# EAGLE design MysensorsATSHA_EEprom (EAGLE 6.5.0)
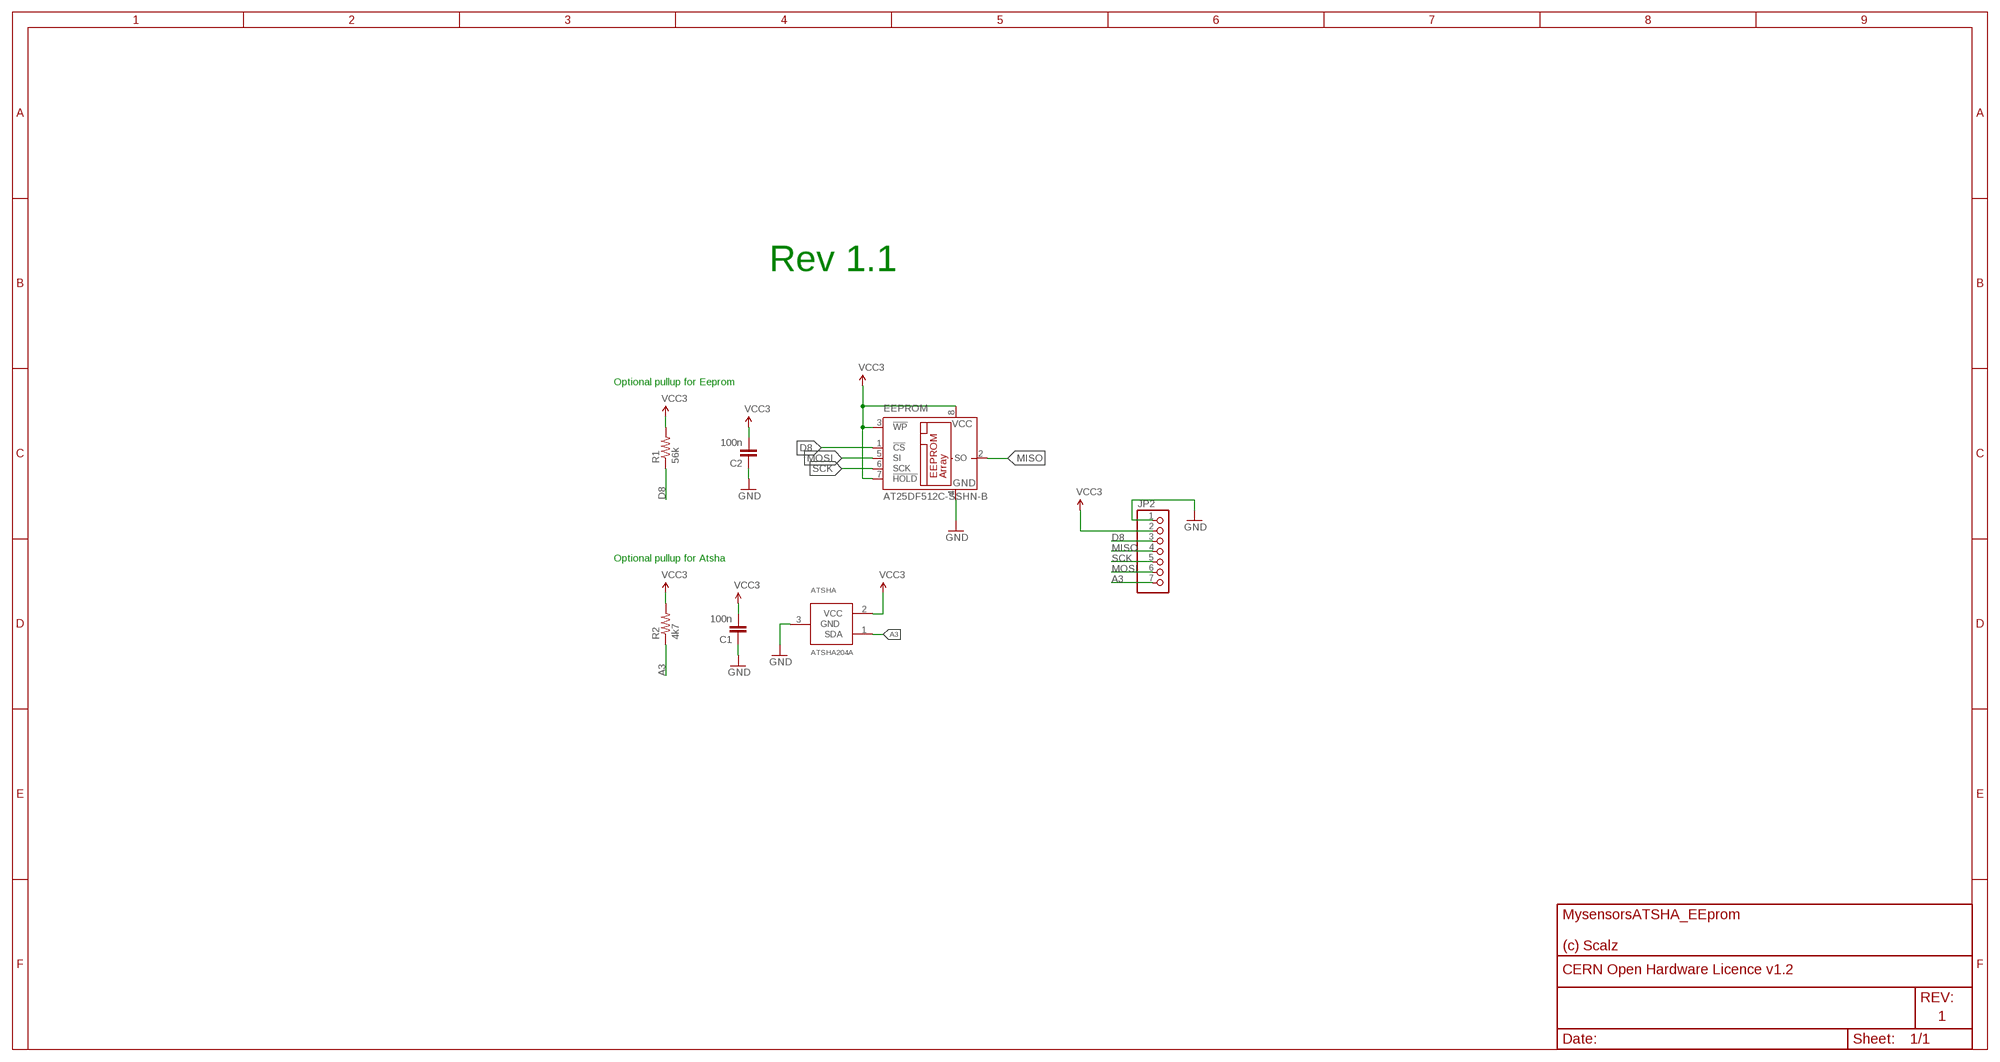
[diagram p0: schematic, sheet 1]

## Parts
ATSHA  ATSHA204A  [SOT23]
C1  100n  CAP1206  [1206]
C2  100n  CAP1206  [1206]
EEPROM  AT25DF512C-SSHN-B  25AA080SN  [SO-08]
JP2  PINHD-1X7  [1X07]
R1  56k  RESISTOR1206  [1206]
R2  4k7  RESISTOR1206  [1206]

## Nets
A3: ATSHA.1(SDA) JP2.7 R2.1
D8: EEPROM.1(!CS) JP2.3 R1.1
GND: ATSHA.3(GND) C1.1 C2.1 EEPROM.4(GND) JP2.1
MISO: EEPROM.2(SO) JP2.4
MOSI: EEPROM.5(SI) JP2.6
SCK: EEPROM.6(SCK) JP2.5
VCC: ATSHA.2(VCC) C1.2 C2.2 EEPROM.3(!WP) EEPROM.7(!HOLD) EEPROM.8(VCC) JP2.2 R1.2 R2.2 ; supply symbol labelled VCC3

## Notes on the sheet
- Rev 1.1
- Optional pullup for Eeprom
- Optional pullup for Atsha

## Library data of the parts
ATSHA = Sensor_tbowmo:ATSHA204A
C1 C2 = LowPowerLab:CAP: Capacitor Standard 0603 ceramic capacitor, and 0.1" leaded capacitor.
EEPROM = microchip:25*: Serial EEPROM 4K/ 8K , SPI bus; MF: MICROCHIP; MPN: 25AA080/SN; OC_FARNELL: 1816072; OC_NEWARK: 92C7351
JP2 = pinhead:PINHD-1X7: PIN HEADER
R1 R2 = SparkFun-Resistors:RESISTOR: Resistor Basic schematic elements and footprints for 0603, 1206, and PTH resistors.

## Net classes
1 Power: width 0.406 mm

## Board
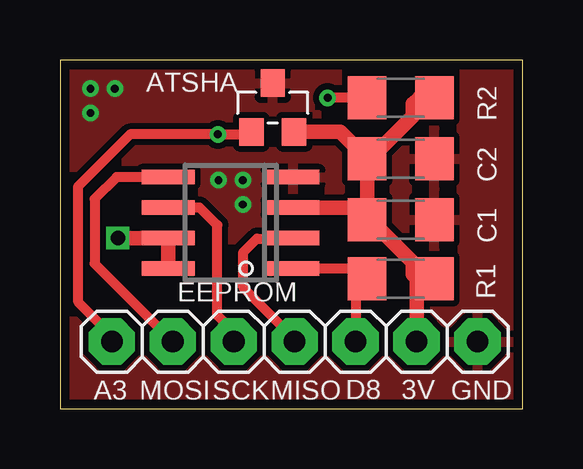
[diagram p1: board, top side]
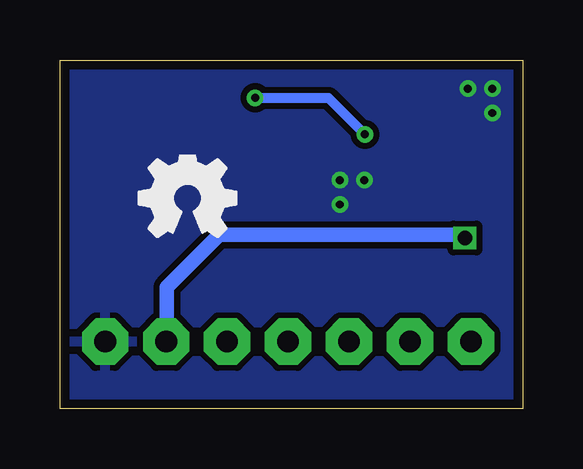
[diagram p2: board, bottom side, seen from below]

Size 19.28 x 14.53 mm. Coordinates in mm from the lower left corner, seen from the top.
Outline: 0,0 19.28,0 19.28,14.53 0,14.53 0,0
Copper layers (1*16): Top 0.0356mm / dielectric 1.5011mm / Bottom 0.0356mm
Design rules "LaenPCBOrder": minimum track width 6mil, minimum drill 13mil, track to track 6mil, track to pad 6mil, pad to pad 6mil, via to via 6mil, smd to smd 6mil, copper to edge 15mil, drill to drill 6mil, minimum pad ring 7mil, minimum via ring 7mil, stop-mask expansion 3mil, vias tented up to drill 0mil, thermal gap 10mil

### Footprints (pad centres in the part's own frame; a part is rotated, then mirrored left to right if it is on the bottom)
SOT23 = smd 1.016 x 1.143: 1 -0.889,-1.016; 2 0.889,-1.016; 3 0,1.016
1206 = smd 1.6 x 1.8: 1 -1.4,0; 2 1.4,0
SO-08 = smd 0.6 x 2.2: 1 -1.905,-2.6; 2 -0.635,-2.6; 3 0.635,-2.6; 4 1.905,-2.6; 5 1.905,2.6; 6 0.635,2.6; 7 -0.635,2.6; 8 -1.905,2.6
1X07 = drill 0.9 pad 1.93 octagon: 1 -7.62,0; 2 -5.08,0; 3 -2.54,0; 4 0,0; 5 2.54,0; 6 5.08,0; 7 7.62,0

### Placement (x,y rotation side)
ATSHA  8.86,12.55 0 top
C1  14.2,7.87 180 top
C2  14.2,10.41 180 top
EEPROM  7.11,7.75 90 top
JP2  9.78,2.79 180 top
R1  14.2,5.41 0 top
R2  14.2,12.95 0 top

### Tracks (layer width: path | path; a pad name or v marks a point on that pad's centre or on a via)
A3  (via drill 0.33 pad 0.64)
  Top 0.406: JP2.7 2.16,3.05 0.76,4.45 0.76,9.27 2.92,11.43 v6.58,11.43 7.87,11.43 ATSHA.1 | R2.1 v11.15,12.95
  Bottom 0.406: v11.15,12.95 8.1,12.95 v6.58,11.43
D8
  Top 0.406: JP2.3 12.32,5.41 R1.1 12.49,5.84 EEPROM.1
GND  (via drill 0.33 pad 0.64)
  other vias: 7.62,9.53 6.6,9.53 7.62,8.51 1.27,13.34 2.29,13.34 1.27,12.32
  pour Top (isolate 0.254): -0.03,16.51 21.82,16.51 21.82,-2.54 -0.03,-2.54
  pour Bottom (isolate 0.254): -1.35,15.75 20.55,15.75 20.29,-1.27 -1.3,-1.27
MISO
  Top 0.406: JP2.4 9.78,2.9 7.65,5.03 7.65,6.53 8.2,7.09 9.69,7.09 EEPROM.2
MOSI
  Top 0.406: EEPROM.5 2.36,9.65 1.45,8.74 1.45,6.04 JP2.6
SCK
  Top 0.406: JP2.5 7.24,3.2 6.55,3.89 6.55,7.64 5.82,8.38 EEPROM.6
VCC  (via drill 0.6)
  Top 0.406: 15.7,5.44 R1.2
  Top 0.61: EEPROM.8 EEPROM.7 v2.41,7.11 | R1.2 15.27,5.03 14.96,5.34 | ATSHA.2 11.68,11.53 C2.2 | C1.2 C2.2 | EEPROM.3 12.29,8.38 C1.2 | C1.2 12.93,7.87 14.71,6.1 14.71,5.6 14.96,5.34 | JP2.2 14.86,5.23 14.96,5.34 | C2.2 12.93,10.41 14.71,12.19 14.71,12.7 14.96,12.95 R2.2
  Bottom 0.406: 2.54,7.24 v2.41,7.11 | 14.83,2.82 JP2.2
  Bottom 0.61: 2.54,7.24 12.65,7.24 14.83,5.05 14.83,2.82

### Text on the board
tPlace: A3 | MOSI | SCK | MISO | D8 | 3V | GND